# Altium schematic sheet progressled.SchDoc
size A4
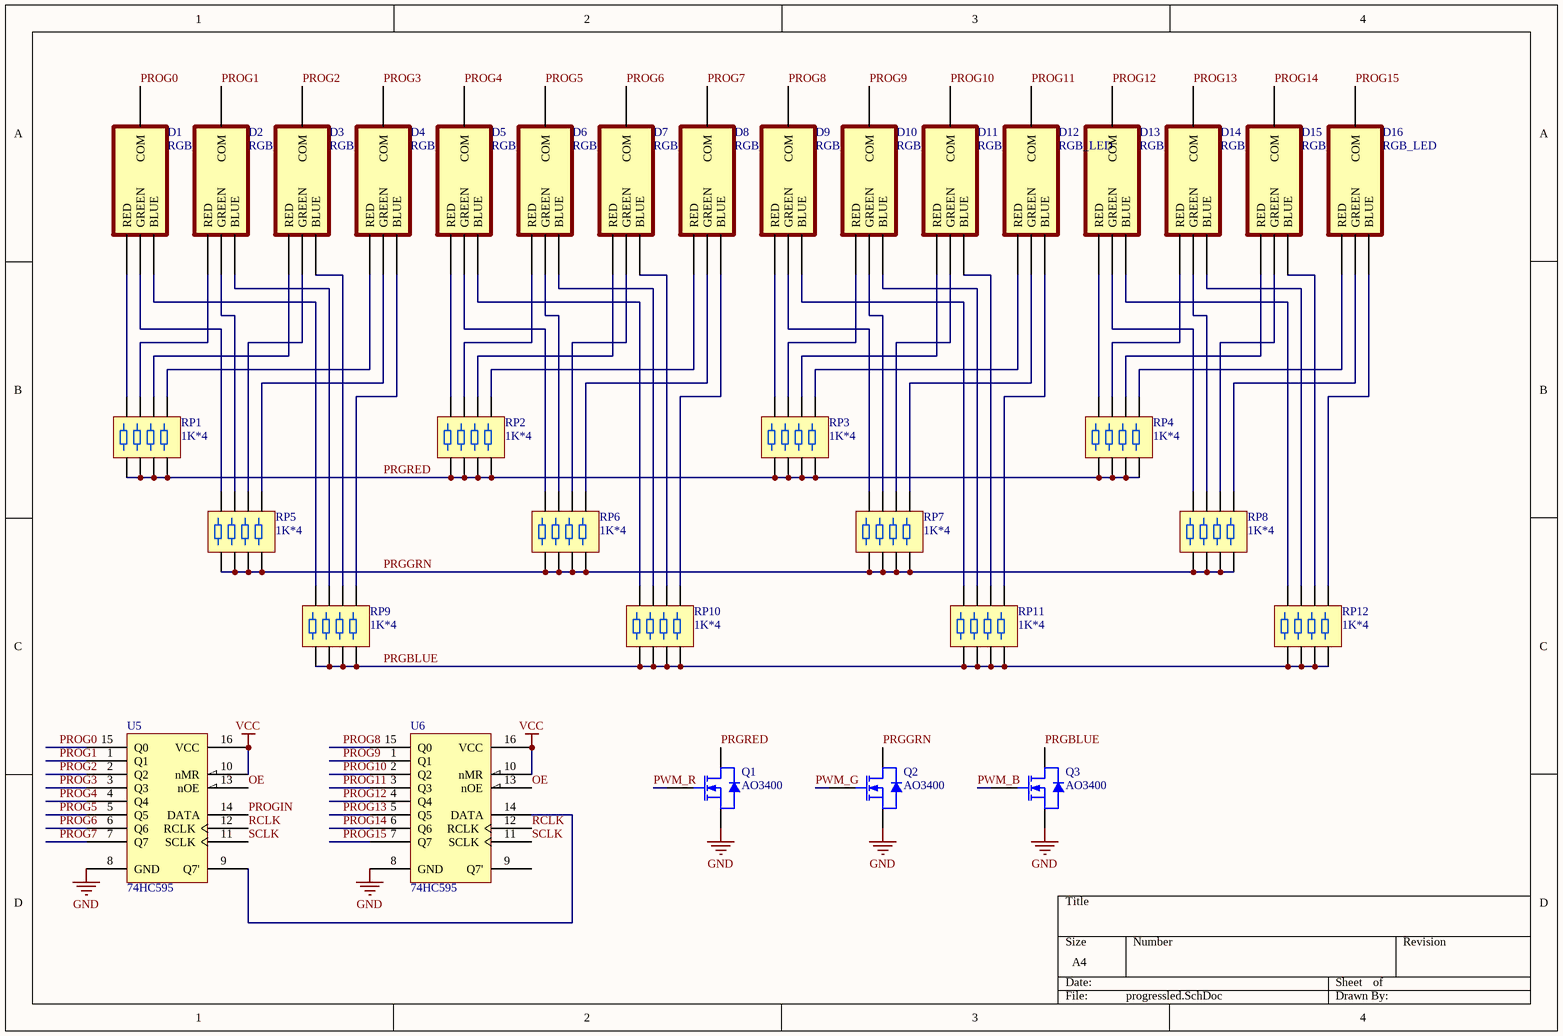
[diagram p0: progressled.SchDoc]

## Parts
D1  RGB_LED  [0805_RGB]
D2  RGB_LED  [0805_RGB]
D3  RGB_LED  [0805_RGB]
D4  RGB_LED  [0805_RGB]
D5  RGB_LED  [0805_RGB]
D6  RGB_LED  [0805_RGB]
D7  RGB_LED  [0805_RGB]
D8  RGB_LED  [0805_RGB]
D9  RGB_LED  [0805_RGB]
D10  RGB_LED  [0805_RGB]
D11  RGB_LED  [0805_RGB]
D12  RGB_LED  [0805_RGB]
D13  RGB_LED  [0805_RGB]
D14  RGB_LED  [0805_RGB]
D15  RGB_LED  [0805_RGB]
D16  RGB_LED  [0805_RGB]
Q1  AO3400  [SOT-23]
Q2  AO3400  [SOT-23]
Q3  AO3400  [SOT-23]
RP1  1K*4  [0603x4]
RP2  1K*4  [0603x4]
RP3  1K*4  [0603x4]
RP4  1K*4  [0603x4]
RP5  1K*4  [0603x4]
RP6  1K*4  [0603x4]
RP7  1K*4  [0603x4]
RP8  1K*4  [0603x4]
RP9  1K*4  [0603x4]
RP10  1K*4  [0603x4]
RP11  1K*4  [0603x4]
RP12  1K*4  [0603x4]
U5  74HC595  [TSSOP16]
U6  74HC595  [TSSOP16]

## Nets
GND: Q1.2(S) Q2.2(S) Q3.2(S) U5.8(GND) U6.8(GND)
VCC: U5.10(nMR) U5.16(VCC) U6.10(nMR) U6.16(VCC)
OE: U5.13(nOE) U6.13(nOE)
PRGBLUE: Q3.3(D) RP9.1 RP9.2 RP9.3 RP9.4 RP10.1 RP10.2 RP10.3 RP10.4 RP11.1 RP11.2 RP11.3 RP11.4 RP12.1 RP12.2 RP12.3 RP12.4
PRGGRN: Q2.3(D) RP5.1 RP5.2 RP5.3 RP5.4 RP6.1 RP6.2 RP6.3 RP6.4 RP7.1 RP7.2 RP7.3 RP7.4 RP8.1 RP8.2 RP8.3 RP8.4
PRGRED: Q1.3(D) RP1.1 RP1.2 RP1.3 RP1.4 RP2.1 RP2.2 RP2.3 RP2.4 RP3.1 RP3.2 RP3.3 RP3.4 RP4.1 RP4.2 RP4.3 RP4.4
PROG0: D1.COM U5.15(Q0)
PROG1: D2.COM U5.1(Q1)
PROG2: D3.COM U5.2(Q2)
PROG3: D4.COM U5.3(Q3)
PROG4: D5.COM U5.4(Q4)
PROG5: D6.COM U5.5(Q5)
PROG6: D7.COM U5.6(Q6)
PROG7: D8.COM U5.7(Q7)
PROG8: D9.COM U6.15(Q0)
PROG9: D10.COM U6.1(Q1)
PROG10: D11.COM U6.2(Q2)
PROG11: D12.COM U6.3(Q3)
PROG12: D13.COM U6.4(Q4)
PROG13: D14.COM U6.5(Q5)
PROG14: D15.COM U6.6(Q6)
PROG15: D16.COM U6.7(Q7)
PROGIN: U5.14(DATA)
PWM_B: Q3.1(G)
PWM_G: Q2.1(G)
PWM_R: Q1.1(G)
RCLK: U5.12(RCLK) U6.12(RCLK)
SCLK: U5.11(SCLK) U6.11(SCLK)
NetD1_B: D1.B(BLUE) RP9.8
NetD1_G: D1.G(GREEN) RP5.8
NetD1_R: D1.R(RED) RP1.8
NetD2_B: D2.B(BLUE) RP9.7
NetD2_G: D2.G(GREEN) RP5.7
NetD2_R: D2.R(RED) RP1.7
NetD3_B: D3.B(BLUE) RP9.6
NetD3_G: D3.G(GREEN) RP5.6
NetD3_R: D3.R(RED) RP1.6
NetD4_B: D4.B(BLUE) RP9.5
NetD4_G: D4.G(GREEN) RP5.5
NetD4_R: D4.R(RED) RP1.5
NetD5_B: D5.B(BLUE) RP10.8
NetD5_G: D5.G(GREEN) RP6.8
NetD5_R: D5.R(RED) RP2.8
NetD6_B: D6.B(BLUE) RP10.7
NetD6_G: D6.G(GREEN) RP6.7
NetD6_R: D6.R(RED) RP2.7
NetD7_B: D7.B(BLUE) RP10.6
NetD7_G: D7.G(GREEN) RP6.6
NetD7_R: D7.R(RED) RP2.6
NetD8_B: D8.B(BLUE) RP10.5
NetD8_G: D8.G(GREEN) RP6.5
NetD8_R: D8.R(RED) RP2.5
NetD9_B: D9.B(BLUE) RP11.8
NetD9_G: D9.G(GREEN) RP7.8
NetD9_R: D9.R(RED) RP3.8
NetD10_B: D10.B(BLUE) RP11.7
NetD10_G: D10.G(GREEN) RP7.7
NetD10_R: D10.R(RED) RP3.7
NetD11_B: D11.B(BLUE) RP11.6
NetD11_G: D11.G(GREEN) RP7.6
NetD11_R: D11.R(RED) RP3.6
NetD12_B: D12.B(BLUE) RP11.5
NetD12_G: D12.G(GREEN) RP7.5
NetD12_R: D12.R(RED) RP3.5
NetD13_B: D13.B(BLUE) RP12.8
NetD13_G: D13.G(GREEN) RP8.8
NetD13_R: D13.R(RED) RP4.8
NetD14_B: D14.B(BLUE) RP12.7
NetD14_G: D14.G(GREEN) RP8.7
NetD14_R: D14.R(RED) RP4.7
NetD15_B: D15.B(BLUE) RP12.6
NetD15_G: D15.G(GREEN) RP8.6
NetD15_R: D15.R(RED) RP4.6
NetD16_B: D16.B(BLUE) RP12.5
NetD16_G: D16.G(GREEN) RP8.5
NetD16_R: D16.R(RED) RP4.5
NetU5_9: U5.9(Q7') U6.14(DATA)

Not connected (* = marked no-connect by the designer): U6 9(Q7')

## Library data of the parts
D1-D16 = RGBLED
Q1-Q3 = AO3400: N-Channel MOSFET; Published: 8-Jun-2000; Revision: July-2002: Re-released for DXP Platform.; Publisher: Altium Limited
RP1-RP12 = RPack_4
U5 U6 = 74HC595: 8-bit serial-in, serial or parallel-out shift register with output latches; 3-state